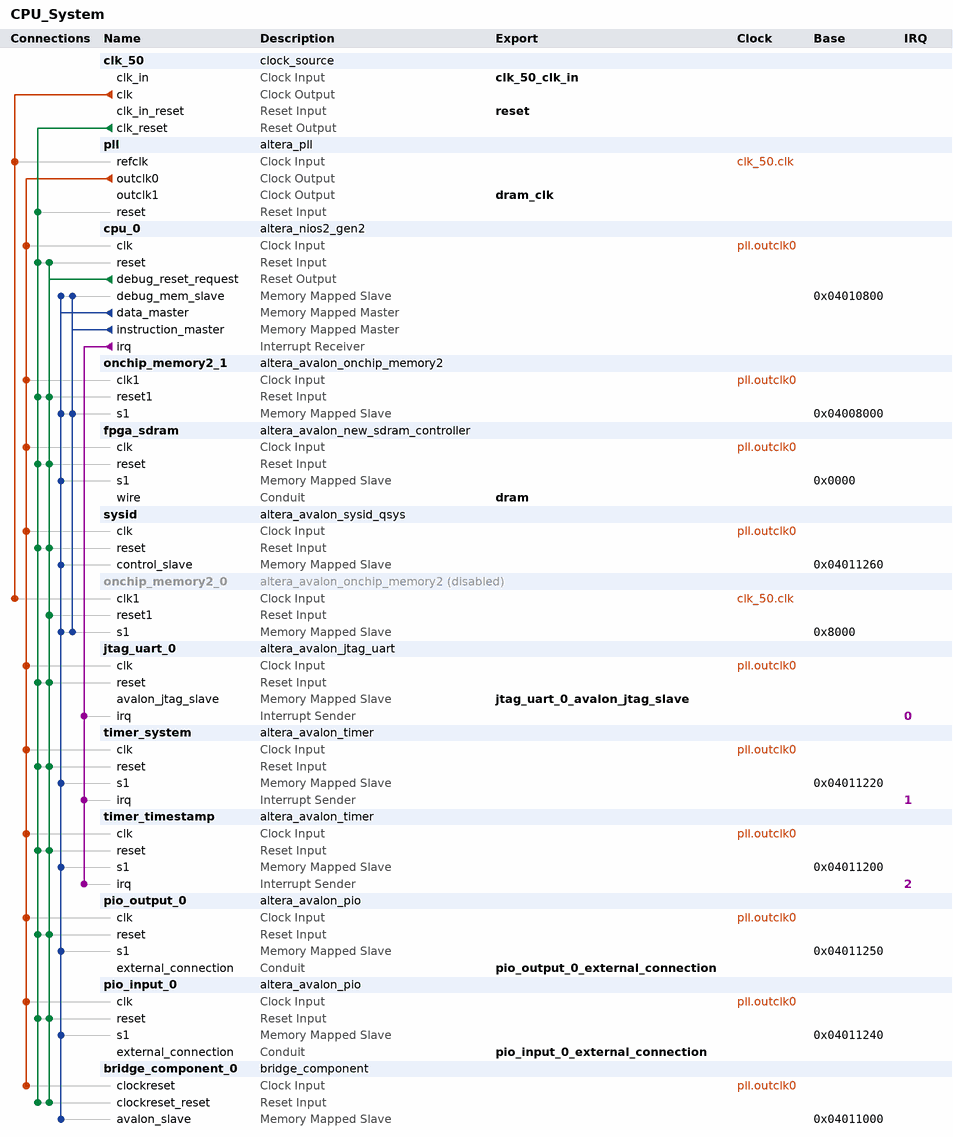
[diagram p0: system contents]
# Platform Designer (Qsys) system CPU_System, Cyclone V 5CSEMA5F31C6
# Parameters at their usual value, and those the tool derives, are not listed.
package require -exact qsys 18.1
create_system CPU_System
set_project_property DEVICE_FAMILY {Cyclone V}
set_project_property DEVICE 5CSEMA5F31C6

add_instance clk_50 clock_source 18.1
set_instance_parameter_value clk_50 clockFrequency 50000000

add_instance pll altera_pll 18.1
set_instance_parameter_value pll gui_device_speed_grade 2
set_instance_parameter_value pll gui_number_of_clocks 2
set_instance_parameter_value pll gui_operation_mode normal
set_instance_parameter_value pll gui_output_clock_frequency0 100.0
set_instance_parameter_value pll gui_output_clock_frequency1 100.0
set_instance_parameter_value pll gui_phase_shift1 -3758
set_instance_parameter_value pll gui_pll_mode {Integer-N PLL}
set_instance_parameter_value pll gui_reference_clock_frequency 50.0
set_instance_parameter_value pll gui_use_locked false

add_instance cpu_0 altera_nios2_gen2 18.1
set_instance_parameter_value cpu_0 dcache_size 2048
set_instance_parameter_value cpu_0 exceptionSlave onchip_memory2_1.s1
set_instance_parameter_value cpu_0 icache_size 4096
set_instance_parameter_value cpu_0 impl Tiny
set_instance_parameter_value cpu_0 resetSlave onchip_memory2_1.s1
set_instance_parameter_value cpu_0 setting_activateTrace true

add_instance onchip_memory2_1 altera_avalon_onchip_memory2 18.1
set_instance_parameter_value onchip_memory2_1 dataWidth 32
set_instance_parameter_value onchip_memory2_1 dualPort false
set_instance_parameter_value onchip_memory2_1 initMemContent true
set_instance_parameter_value onchip_memory2_1 initializationFileName onchip_mem.hex
set_instance_parameter_value onchip_memory2_1 memorySize 32768

add_instance fpga_sdram altera_avalon_new_sdram_controller 18.1
set_instance_parameter_value fpga_sdram TAC 5.4
set_instance_parameter_value fpga_sdram TRCD 15.0
set_instance_parameter_value fpga_sdram TRP 15.0
set_instance_parameter_value fpga_sdram casLatency 3
set_instance_parameter_value fpga_sdram columnWidth 10
set_instance_parameter_value fpga_sdram dataWidth 16
set_instance_parameter_value fpga_sdram generateSimulationModel false
set_instance_parameter_value fpga_sdram model single_Micron_MT48LC4M32B2_7_chip
set_instance_parameter_value fpga_sdram numberOfBanks 4
set_instance_parameter_value fpga_sdram numberOfChipSelects 1
set_instance_parameter_value fpga_sdram powerUpDelay 100.0
set_instance_parameter_value fpga_sdram refreshPeriod 7.8125
set_instance_parameter_value fpga_sdram rowWidth 13

add_instance sysid altera_avalon_sysid_qsys 18.1
set_instance_parameter_value sysid id 123456

add_instance onchip_memory2_0 altera_avalon_onchip_memory2 18.1
set_instance_property onchip_memory2_0 ENABLED false
set_instance_parameter_value onchip_memory2_0 dataWidth 32
set_instance_parameter_value onchip_memory2_0 dualPort false
set_instance_parameter_value onchip_memory2_0 initMemContent true
set_instance_parameter_value onchip_memory2_0 initializationFileName onchip_mem.hex
set_instance_parameter_value onchip_memory2_0 memorySize 32768

add_instance jtag_uart_0 altera_avalon_jtag_uart 18.1
set_instance_parameter_value jtag_uart_0 simInteractiveOptions INTERACTIVE_ASCII_OUTPUT

add_instance timer_system altera_avalon_timer 18.1
set_instance_parameter_value timer_system period 1
set_instance_parameter_value timer_system periodUnits MSEC

add_instance timer_timestamp altera_avalon_timer 18.1
set_instance_parameter_value timer_timestamp period 1
set_instance_parameter_value timer_timestamp periodUnits MSEC

add_instance pio_output_0 altera_avalon_pio 18.1
set_instance_parameter_value pio_output_0 direction Output
set_instance_parameter_value pio_output_0 width 8

add_instance pio_input_0 altera_avalon_pio 18.1
set_instance_parameter_value pio_input_0 direction Input
set_instance_parameter_value pio_input_0 width 8

add_instance bridge_component_0 bridge_component 1.0

# connections
add_connection clk_50.clk onchip_memory2_0.clk1 clock
add_connection clk_50.clk pll.refclk clock
add_connection pll.outclk0 bridge_component_0.clockreset clock
add_connection pll.outclk0 cpu_0.clk clock
add_connection pll.outclk0 fpga_sdram.clk clock
add_connection pll.outclk0 jtag_uart_0.clk clock
add_connection pll.outclk0 onchip_memory2_1.clk1 clock
add_connection pll.outclk0 pio_input_0.clk clock
add_connection pll.outclk0 pio_output_0.clk clock
add_connection pll.outclk0 sysid.clk clock
add_connection pll.outclk0 timer_system.clk clock
add_connection pll.outclk0 timer_timestamp.clk clock
add_connection clk_50.clk_reset bridge_component_0.clockreset_reset reset
add_connection clk_50.clk_reset cpu_0.reset reset
add_connection clk_50.clk_reset fpga_sdram.reset reset
add_connection clk_50.clk_reset jtag_uart_0.reset reset
add_connection clk_50.clk_reset onchip_memory2_1.reset1 reset
add_connection clk_50.clk_reset pio_input_0.reset reset
add_connection clk_50.clk_reset pio_output_0.reset reset
add_connection clk_50.clk_reset pll.reset reset
add_connection clk_50.clk_reset sysid.reset reset
add_connection clk_50.clk_reset timer_system.reset reset
add_connection clk_50.clk_reset timer_timestamp.reset reset
add_connection cpu_0.debug_reset_request bridge_component_0.clockreset_reset reset
add_connection cpu_0.debug_reset_request cpu_0.reset reset
add_connection cpu_0.debug_reset_request fpga_sdram.reset reset
add_connection cpu_0.debug_reset_request jtag_uart_0.reset reset
add_connection cpu_0.debug_reset_request onchip_memory2_0.reset1 reset
add_connection cpu_0.debug_reset_request onchip_memory2_1.reset1 reset
add_connection cpu_0.debug_reset_request pio_input_0.reset reset
add_connection cpu_0.debug_reset_request pio_output_0.reset reset
add_connection cpu_0.debug_reset_request sysid.reset reset
add_connection cpu_0.debug_reset_request timer_system.reset reset
add_connection cpu_0.debug_reset_request timer_timestamp.reset reset
add_connection cpu_0.data_master bridge_component_0.avalon_slave avalon
set_connection_parameter_value cpu_0.data_master/bridge_component_0.avalon_slave baseAddress 0x04011000
add_connection cpu_0.data_master cpu_0.debug_mem_slave avalon
set_connection_parameter_value cpu_0.data_master/cpu_0.debug_mem_slave baseAddress 0x04010800
add_connection cpu_0.data_master fpga_sdram.s1 avalon
set_connection_parameter_value cpu_0.data_master/fpga_sdram.s1 baseAddress 0x0000
add_connection cpu_0.data_master onchip_memory2_0.s1 avalon
set_connection_parameter_value cpu_0.data_master/onchip_memory2_0.s1 baseAddress 0x8000
add_connection cpu_0.data_master onchip_memory2_1.s1 avalon
set_connection_parameter_value cpu_0.data_master/onchip_memory2_1.s1 baseAddress 0x04008000
add_connection cpu_0.data_master pio_input_0.s1 avalon
set_connection_parameter_value cpu_0.data_master/pio_input_0.s1 baseAddress 0x04011240
add_connection cpu_0.data_master pio_output_0.s1 avalon
set_connection_parameter_value cpu_0.data_master/pio_output_0.s1 baseAddress 0x04011250
add_connection cpu_0.data_master sysid.control_slave avalon
set_connection_parameter_value cpu_0.data_master/sysid.control_slave baseAddress 0x04011260
add_connection cpu_0.data_master timer_system.s1 avalon
set_connection_parameter_value cpu_0.data_master/timer_system.s1 baseAddress 0x04011220
add_connection cpu_0.data_master timer_timestamp.s1 avalon
set_connection_parameter_value cpu_0.data_master/timer_timestamp.s1 baseAddress 0x04011200
add_connection cpu_0.instruction_master cpu_0.debug_mem_slave avalon
set_connection_parameter_value cpu_0.instruction_master/cpu_0.debug_mem_slave baseAddress 0x04010800
add_connection cpu_0.instruction_master onchip_memory2_0.s1 avalon
set_connection_parameter_value cpu_0.instruction_master/onchip_memory2_0.s1 baseAddress 0x8000
add_connection cpu_0.instruction_master onchip_memory2_1.s1 avalon
set_connection_parameter_value cpu_0.instruction_master/onchip_memory2_1.s1 baseAddress 0x04008000
add_connection cpu_0.irq jtag_uart_0.irq interrupt
set_connection_parameter_value cpu_0.irq/jtag_uart_0.irq irqNumber 0
add_connection cpu_0.irq timer_system.irq interrupt
set_connection_parameter_value cpu_0.irq/timer_system.irq irqNumber 1
add_connection cpu_0.irq timer_timestamp.irq interrupt
set_connection_parameter_value cpu_0.irq/timer_timestamp.irq irqNumber 2

# exported interfaces
add_interface clk_50_clk_in clock sink
set_interface_property clk_50_clk_in EXPORT_OF clk_50.clk_in
add_interface dram conduit end
set_interface_property dram EXPORT_OF fpga_sdram.wire
add_interface dram_clk clock source
set_interface_property dram_clk EXPORT_OF pll.outclk1
add_interface jtag_uart_0_avalon_jtag_slave avalon slave
set_interface_property jtag_uart_0_avalon_jtag_slave EXPORT_OF jtag_uart_0.avalon_jtag_slave
add_interface pio_input_0_external_connection conduit end
set_interface_property pio_input_0_external_connection EXPORT_OF pio_input_0.external_connection
add_interface pio_output_0_external_connection conduit end
set_interface_property pio_output_0_external_connection EXPORT_OF pio_output_0.external_connection
add_interface reset reset sink
set_interface_property reset EXPORT_OF clk_50.clk_in_reset

set_interconnect_requirement {$system} qsys_mm.clockCrossingAdapter HANDSHAKE
set_interconnect_requirement {$system} qsys_mm.maxAdditionalLatency 0

save_system CPU_System.qsys
